# EAGLE design WimarcFarmArduinoShield (EAGLE 7.2.0)
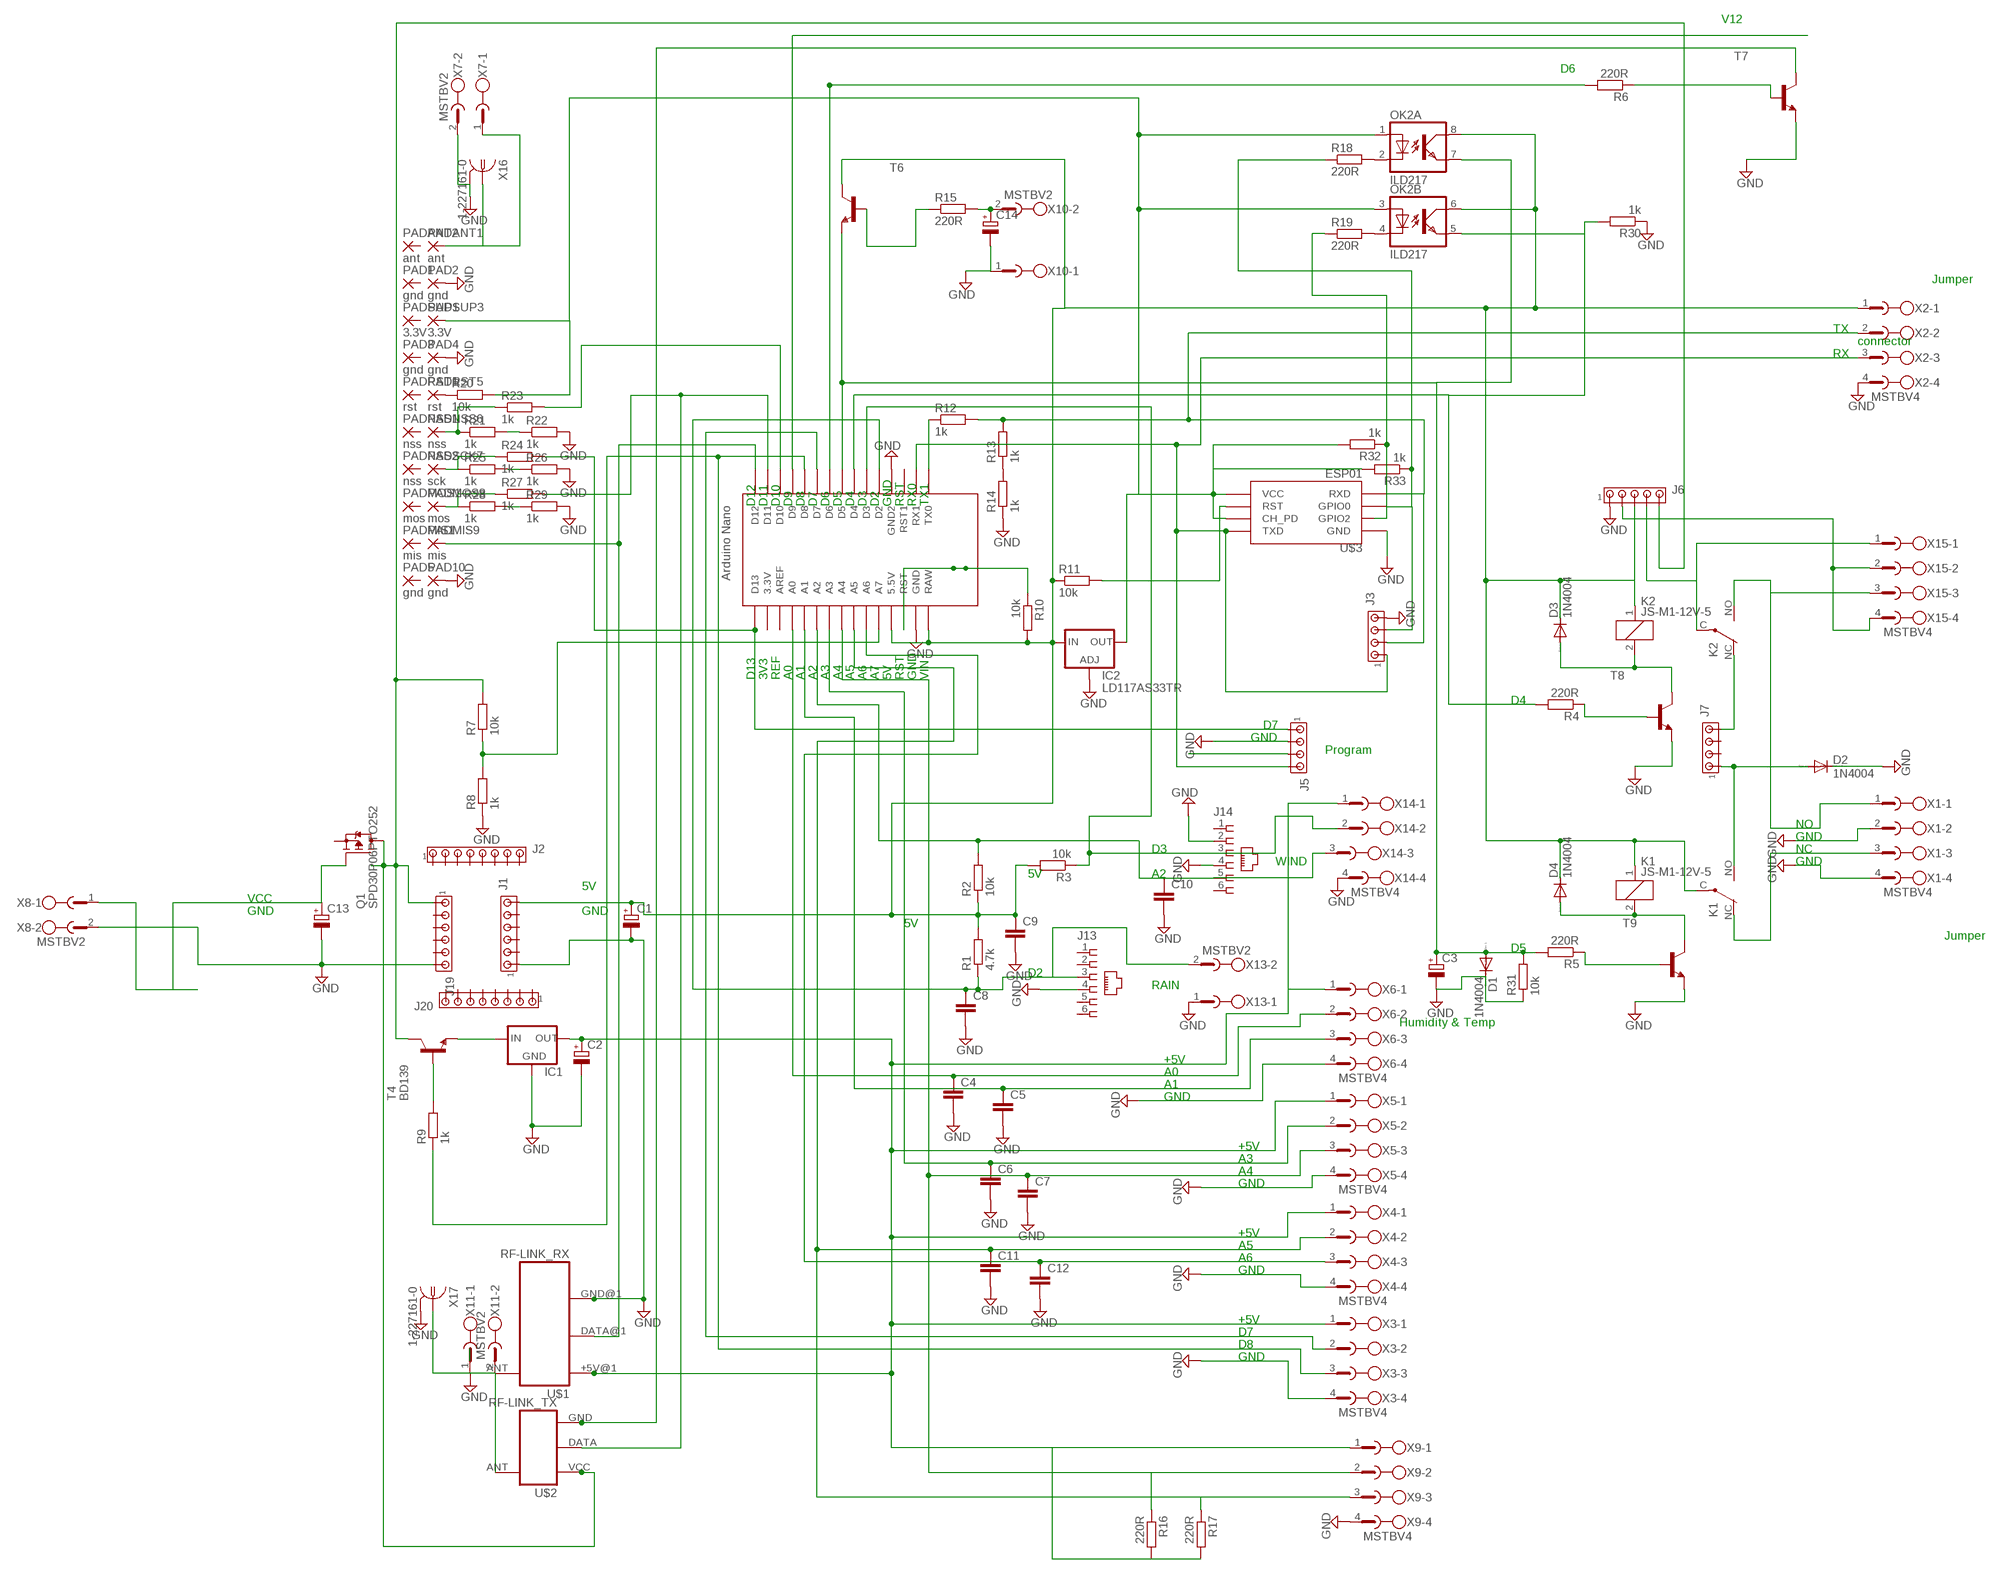
[diagram p0: schematic, sheet 1]

## Parts
C1  CPOL-EUE2.5-7  [E2,5-7]
C2  CPOL-EUE3.5-10  [E3,5-10]
C3  CPOL-EUE2.5-7  [E2,5-7]
C4  C-EUC0805K  [C0805K]
C5  C-EUC0805K  [C0805K]
C6  C-EUC0805K  [C0805K]
C7  C-EUC0805K  [C0805K]
C8  C-EUC0805K  [C0805K]
C9  C-EUC0805K  [C0805K]
C10  C-EUC0805K  [C0805K]
C11  C-EUC0805K  [C0805K]
C12  C-EUC0805K  [C0805K]
C13  CPOL-EUE2.5-7  [E2,5-7]
C14  CPOL-EUE2.5-7  [E2,5-7]
D1  1N4004  [DO41-10]
D2  1N4004  [DO41-10]
D3  1N4004  [DO41-10]
D4  1N4004  [DO41-10]
IC1  78XXS  [78XXS]
IC2  LD117AS33TR  [SOT223]
J1  MTA06-100  [10X06MTA]
J2  MTA08-100  [10X08MTA]
J3  MTA04-100  [10X04MTA]
J5  MTA04-100  [10X04MTA]
J6  MTA05-100  [10X05MTA]
J7  MTA04-100  [10X04MTA]
J13  520250-3  [520250-3]
J14  520250-3  [520250-3]
J19  MTA06-100  [10X06MTA]
J20  MTA08-100  [10X08MTA]
K1  JS-M1-12V-5  [JS-M]
K2  JS-M1-12V-5  [JS-M]
OK2  ILD217  [SOIC08]
PAD1  gnd  1,6/0,8  [1,6/0,8]
PAD2  gnd  1,6/0,8  [1,6/0,8]
PAD3  gnd  1,6/0,8  [1,6/0,8]
PAD4  gnd  1,6/0,8  [1,6/0,8]
PAD5  gnd  1,6/0,8  [1,6/0,8]
PAD10  gnd  1,6/0,8  [1,6/0,8]
PADANT1  ant  1,6/0,8  [1,6/0,8]
PADANT2  ant  1,6/0,8  [1,6/0,8]
PADMIS1  mis  1,6/0,8  [1,6/0,8]
PADMIS9  mis  1,6/0,8  [1,6/0,8]
PADMOS1  mos  1,6/0,8  [1,6/0,8]
PADMOS8  mos  1,6/0,8  [1,6/0,8]
PADNSS1  nss  1,6/0,8  [1,6/0,8]
PADNSS2  nss  1,6/0,8  [1,6/0,8]
PADNSS6  nss  1,6/0,8  [1,6/0,8]
PADRST1  rst  1,6/0,8  [1,6/0,8]
PADRST5  rst  1,6/0,8  [1,6/0,8]
PADSCK7  sck  1,6/0,8  [1,6/0,8]
PADSUP1  3.3V  1,6/0,8  [1,6/0,8]
PADSUP3  3.3V  1,6/0,8  [1,6/0,8]
Q1  SPD30P06PTO252  [TO252]
R1  4.7k  R-EU_M0805  [M0805]
R2  10k  R-EU_M0805  [M0805]
R3  10k  R-EU_M0805  [M0805]
R4  220R  R-EU_M0805  [M0805]
R5  220R  R-EU_M0805  [M0805]
R6  220R  R-EU_M0805  [M0805]
R7  10k  R-EU_M0805  [M0805]
R8  1k  R-EU_M0805  [M0805]
R9  1k  R-EU_M0805  [M0805]
R10  10k  R-EU_M0805  [M0805]
R11  10k  R-EU_M0805  [M0805]
R12  1k  R-EU_M0805  [M0805]
R13  1k  R-EU_M0805  [M0805]
R14  1k  R-EU_M0805  [M0805]
R15  220R  R-EU_M0805  [M0805]
R16  220R  R-EU_M0805  [M0805]
R17  220R  R-EU_M0805  [M0805]
R18  220R  R-EU_M0805  [M0805]
R19  220R  R-EU_M0805  [M0805]
R20  10k  R-EU_M0805  [M0805]
R21  1k  R-EU_M0805  [M0805]
R22  1k  R-EU_M0805  [M0805]
R23  1k  R-EU_M0805  [M0805]
R24  1k  R-EU_M0805  [M0805]
R25  1k  R-EU_M0805  [M0805]
R26  1k  R-EU_M0805  [M0805]
R27  1k  R-EU_M0805  [M0805]
R28  1k  R-EU_M0805  [M0805]
R29  1k  R-EU_M0805  [M0805]
R30  1k  R-EU_M0805  [M0805]
R31  10k  R-EU_M0805  [M0805]
R32  1k  R-EU_M0805  [M0805]
R33  1k  R-EU_M0805  [M0805]
T4  BD139  [TO126]
T6  -NPN-SOT89-BCE  [SOT89-BCE]
T7  -NPN-SOT89-BCE  [SOT89-BCE]
T8  -NPN-SOT89-BCE  [SOT89-BCE]
T9  -NPN-SOT89-BCE  [SOT89-BCE]
U$1  RF-LINK_RX  [RF-LINK_RX]
U$2  RF-LINK_TX  [RF-LINK_TX]
U$3  ESP01  [ESP01]
U$4  NANO  [NANO]
X1  MSTBV4  [MSTBV4]
X2  MSTBV4  [MSTBV4]
X3  MSTBV4  [MSTBV4]
X4  MSTBV4  [MSTBV4]
X5  MSTBV4  [MSTBV4]
X6  MSTBV4  [MSTBV4]
X7  MSTBV2  [MSTBV2]
X8  MSTBV2  [MSTBV2]
X9  MSTBV4  [MSTBV4]
X10  MSTBV2  [MSTBV2]
X11  MSTBV2  [MSTBV2]
X13  MSTBV2  [MSTBV2]
X14  MSTBV4  [MSTBV4]
X15  MSTBV4  [MSTBV4]
X16  1-227161-0  [AMP_227161]
X17  1-227161-0  [AMP_227161]

## Nets
GND: C1.- C2.- C3.- C4.2 C5.2 C6.2 C7.2 C8.2 C9.2 C10.2 C11.2 C12.2 C13.- C14.- D1.C D2.C IC1.GND IC2.1(ADJ) J1.1 J3.4 J5.2 J6.1 J13.4 J14.2 J14.4 J19.6 PAD2.1(P) PAD4.1(P) PAD10.1(P) R8.1 R14.1 R22.2 R26.2 R29.2 R30.1 R31.1 T7.E T8.E T9.E U$1.GND@1(GND) U$3.GND U$4.GND U$4.GND1(GND2) X1.2 X1.4 X2.4 X3.4 X4.4 X5.4 X6.4 X7.2 X8.2 X9.4 X10.1 X11.1 X13.1 X14.4 X16.2 X17.2
N$1: C4.1 U$4.A0 X6.2
N$2: C8.1 J13.3 R1.1 U$4.D2 X13.2
N$3: J14.3 R3.1 U$4.D3 X14.2
N$5: J7.4 K2.NC(2:O)
N$6: J5.1 R24.2 U$4.D13
N$7: C13.+ Q1.1(G) X8.1
N$8: J3.1 J5.4 U$3.TX(TXD) U$4.RX1 X2.3
N$9: J5.3
N$10: U$1.ANT U$2.ANT X11.2 X17.1
N$11: PADMIS9.1(P) U$1.DATA@1(DATA) U$4.D12
N$12: J3.3 R18.1 R33.1 U$3.GPIO0
N$13: C5.1 U$4.A1 X6.3
N$14: C6.1 U$4.A3 X5.2
N$15: C7.1 R16.1 U$4.A4 X5.3 X9.2
N$16: C11.1 R17.1 U$4.A5 X4.2 X9.3
N$17: C12.1 U$4.A6 X4.3
N$18: U$4.D7 X3.2
N$19: R11.2 U$3.RST
N$20: D3.A K2.2 T8.C
N$21: C2.+ IC1.OUT R16.2 R17.2 U$1.+5V@1(+5V) X3.1 X4.1 X5.1 X6.1 X9.1 X14.1
N$22: R4.1 T8.B
N$23: D4.A K1.2 T9.C
N$24: R5.1 T9.B
N$25: K1.NC(2:O) X1.3
N$26: T7.C U$2.GND
N$27: R27.2 U$2.DATA U$4.D11
N$28: K2.NO(2:S) X1.1 X15.3
N$29: R7.1 R8.2 U$4.A7
N$30: R6.1 T7.B
N$31: OK2.5(B:EMIT) R4.2 R30.2 U$4.D4
N$32: C3.+ D1.A OK2.7(A:EMIT) R5.2 R31.2 T6.E U$4.D5
N$33: R6.2 U$4.D6
N$34: R12.1 U$4.TX0
N$35: U$4.D9
N$36: D2.A J7.1 K1.NO(2:S)
N$37: R23.2 U$4.D10
N$38: IC1.IN T4.1(E)
N$39: R9.2 T4.3(B)
N$40: R9.1 U$4.D8 X3.3
N$42: R10.1 U$4.ICSP1 U$4.ICSP2 U$4.RST
N$43: IC2.4(OUT) OK2.1(A:A) OK2.3(B:A) PADSUP3.1(P) R20.2 R32.2 R33.2 U$3.CH_PD U$3.VCC
N$44: J3.2 R12.2 R13.2 U$3.RX(RXD) X2.2
N$47: J6.4 K2.C(2:P) X15.1
N$48: R15.1 T6.B
N$49: C14.+ R15.2 X10.2
N$50: R19.1 R32.1 U$3.GPIO2
N$51: OK2.2(A:C) R18.2
N$52: R13.1 R14.2
N$53: OK2.4(B:C) R19.2
N$54: J6.2 X15.2 X15.4
N$55: C10.1 J14.5 R2.2 U$4.A2 X14.3
N$61: PADSCK7.1(P) R24.1 R25.1
N$62: PADRST5.1(P) R20.1
N$63: PADNSS6.1(P) R21.1 R23.1
N$64: R21.2 R22.1
N$65: R25.2 R26.1
N$66: PADMOS8.1(P) R27.1 R28.1
N$67: R28.2 R29.1
N$68: PADANT1.1(P) X7.1 X16.1
N$72: C1.+ C9.1 D3.C D4.C IC2.3(IN) J1.6 J6.3 K1.1 K1.C(2:P) K2.1 OK2.6(B:COL) OK2.8(A:COL) R1.2 R2.1 R3.2 R10.2 R11.1 T6.C U$4.5V(5.5V) U$4.RAW X2.1
SUPPLY: J6.5 J19.1 Q1.3(D) R7.2 T4.2(C) U$2.VCC(+5V)
Unconnected: J1.2 J1.3 J1.4 J1.5 J2.1 J2.2 J2.3 J2.4 J2.5 J2.6 J2.7 J2.8 J7.2 J7.3 J13.1 J13.2 J13.5 J13.6 J14.1 J14.6 J19.2 J19.3 J19.4 J19.5 J20.1 J20.2 J20.3 J20.4 J20.5 J20.6 J20.7 J20.8 PAD1.1(P) PAD3.1(P) PAD5.1(P) PADANT2.1(P) PADMIS1.1(P) PADMOS1.1(P) PADNSS1.1(P) PADNSS2.1(P) PADRST1.1(P) PADSUP1.1(P) Q1.2(S) U$4.3.3V U$4.AREF U$4.ICSP3 U$4.ICSP4 U$4.ICSP5 U$4.ICSP6 U$4.RST1

## Notes on the sheet
- V12
- D6
- Jumper
- TX
- connector
- RX
- D12 | D11 | D10 | D9 | D8 | D7 | D6 | D5 | D4 | D3 | D2 | GND | RST | RX0 | TX1
- D13 | 3V3 | REF | A0 | A1 | A2 | A3 | A4 | A5 | A6 | A7 | 5V | RST | GND | VIN
- D4
- D7
- GND
- Program
- NO
- GND
- D3 | NC
- WIND | GND
- 5V | A2
- 5V
- VCC
- GND | GND
- 5V
- Jumper
- D5
- D2
- RAIN
- Humidity & Temp
- +5V
- A0
- A1
- GND
- +5V
- A3
- A4
- GND
- +5V
- A5
- A6
- GND
- +5V
- D7
- D8
- GND

## Library data of the parts
C1-C3 C13 C14 = rcl:CPOL-EU: POLARIZED CAPACITOR, European symbol
C4-C12 = rcl:C-EU: CAPACITOR, European symbol
D1-D4 = diode:1N4004: DIODE general purpose rectifier, 1 A
IC1 = v-reg:78XXS: VOLTAGE REGULATOR
IC2 = v-reg:LD117A?*: Low drop fixed and adjustable positive voltage regulators 1 A Source: http://www.st.com/stonline/products/literature/ds/7194/ld1117axx.pdf
J1 J19 = con-amp:MTA06-100: AMP connector Connection corrected 2014-09-19
J2 J20 = con-amp:MTA08-100: AMP connector
J3 J5 J7 = con-amp:MTA04-100: AMP connector
J6 = con-amp:MTA05-100: AMP connector
J13 J14 = con-amp:520250-3: AMP connector
K1 K2 = relay:JS-M1*: Automotive Ultra-Miniature Power Relay NAiS Source: http://www.mew-europe.com/.. en_ds_61211_0000.pdf
OK2 = optocoupler-2:ILD2*: Siemens ILD205/206/207/211/213/217 DUAL PHOTOTRANSISTOR SMALL OUTLINE SURFACE MOUNT OPTOCOUPLER Source: 153385-da-01-en-Optocoupler_ILD205-T.pdf
PAD1-PAD5 PAD10 PADANT1 PADANT2 PADMIS1 PADMIS9 PADMOS1 PADMOS8 PADNSS1 PADNSS2 PADNSS6 PADRST1 PADRST5 PADSCK7 PADSUP1 PADSUP3 = wirepad:1,6/0,8: THROUGH-HOLE PAD
Q1 = transistor-fet:SPD30P06P: SIPMOS(R) Power-Transistor P-Channel, Enhancement mode Source: http://www.infineon.com/upload/Document/cmc_upload/documents/012/3615/SPD_U30P06P.pdf
R1-R33 = resistor:R-EU_: RESISTOR, European symbol
T4 = transistor-npn:BD139*: NPN Transistor
T6-T9 = transistor:*-NPN-: NPN Transistror BF959 corrected 2008.03.06
U$1 = SparkFun-RF:RF-LINK_RX: RF Link receivers- WRL-8947, 8948, 8949, 8950, 10532, 10533
U$2 = SparkFun-RF:RF-LINK_TX: RF Link transmitters WRL-8945, 8946
U$3 = esp8266modules:ESP01: ESP8266 Wifi module 01
U$4 = Arduino-clone:NANO: Arduino Nano
X1-X6 X9 X14 X15 = con-phoenix-508:MSTBV4: PHOENIX
X7 X8 X10 X11 X13 = con-phoenix-508:MSTBV2: PHOENIX
X16 X17 = con-coax:?227161*: JACK, RIGHT ANGLE, 50 OHM, PCB, BNC Source: amp_227161.pdf; MF: TYCO ELECTRONICS; MPN: 1-227161; OC_FARNELL: unknown; OC_NEWARK: 33B3200

## Board
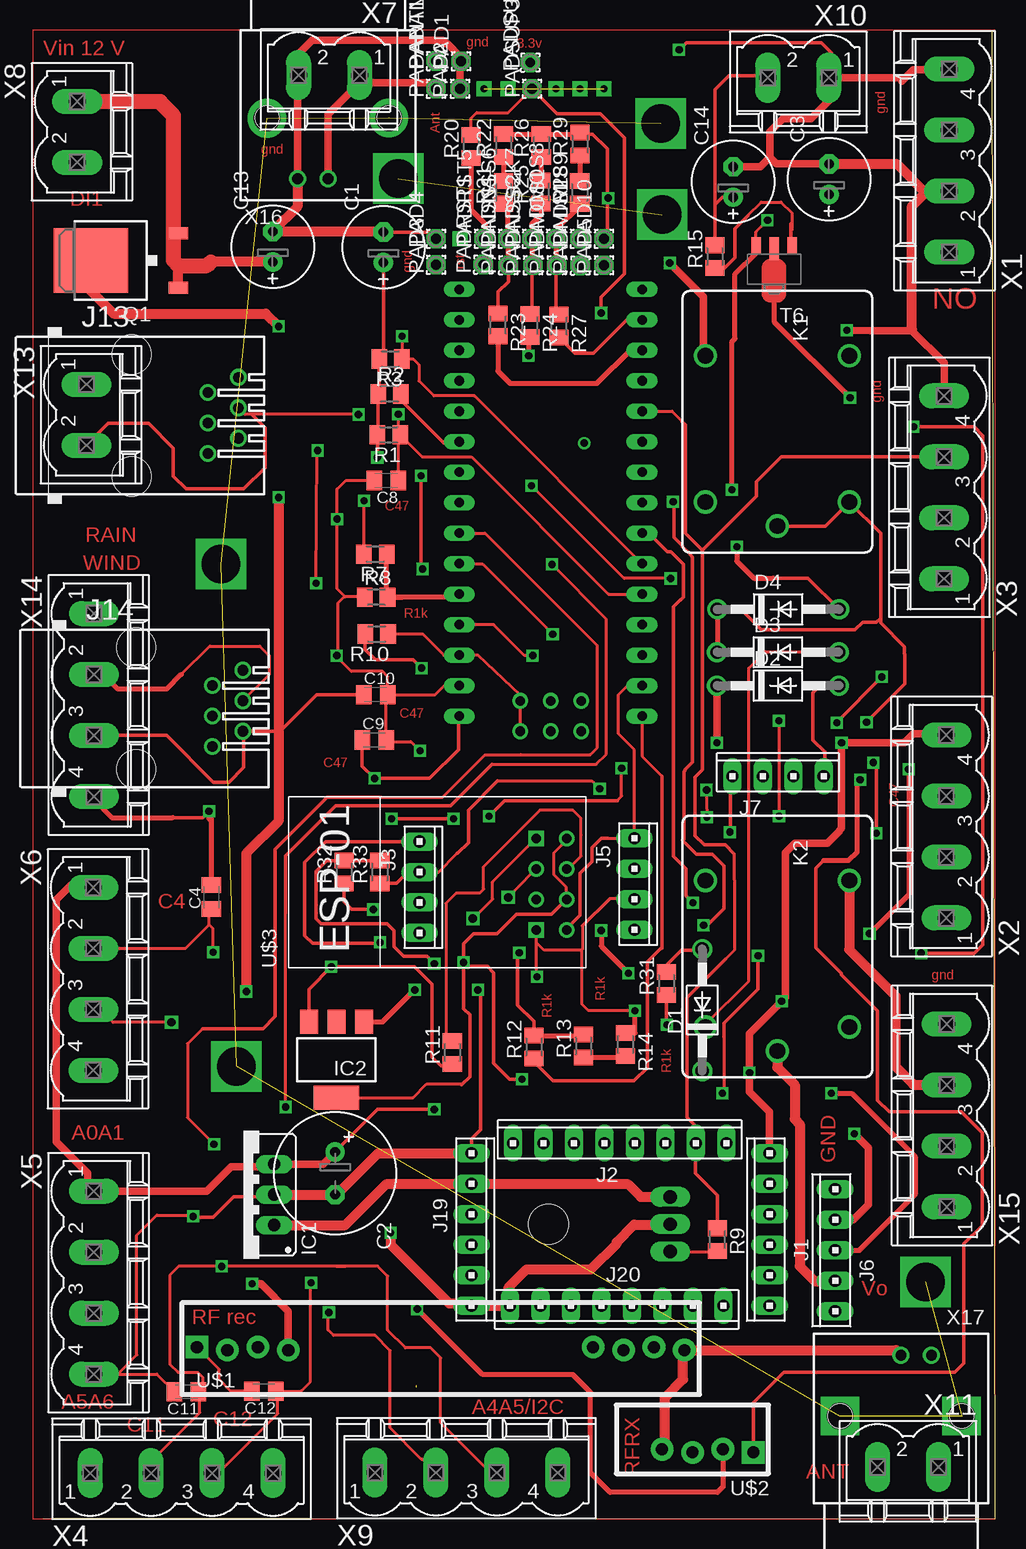
[diagram p1: board, top side]
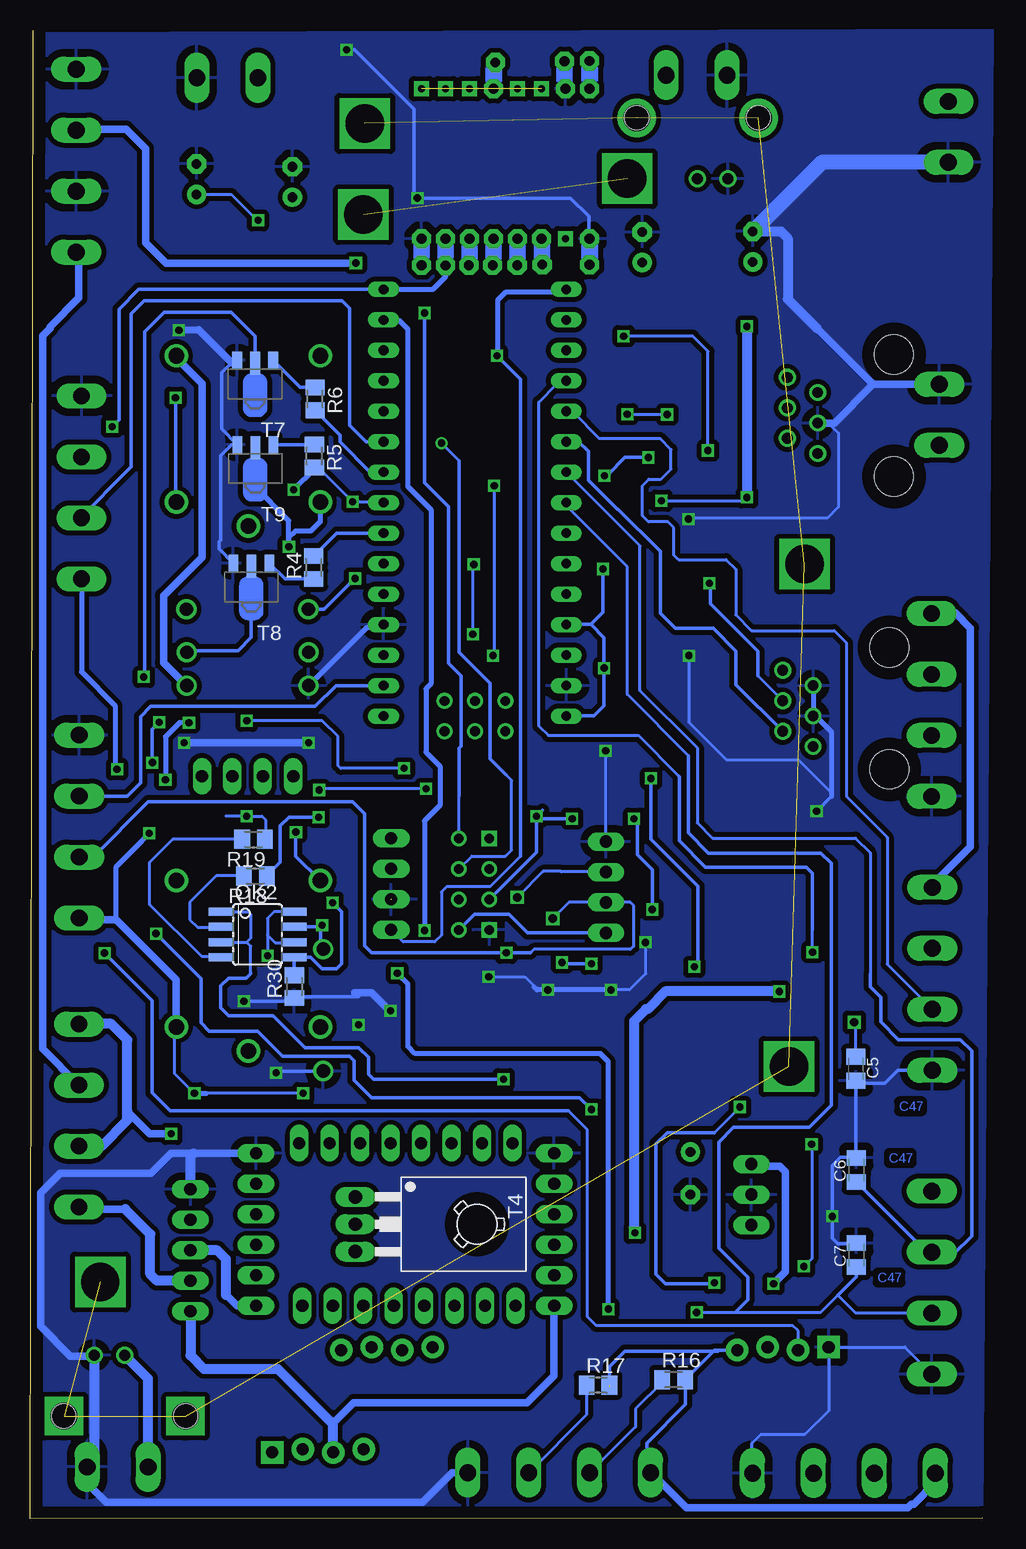
[diagram p2: board, bottom side, seen from below]

Size 79.39 x 124.01 mm. Coordinates in mm from the lower left corner, seen from the top.
Outline: 0,0.03 79.39,0 79.14,124.01
Copper layers (1*16): Top 0.035mm / dielectric 1.5mm / Bottom 0.035mm
Design rules "default *": minimum track width 10mil, minimum drill 24mil, track to track 10mil, track to pad 10mil, pad to pad 10mil, via to via 10mil, smd to smd 10mil, copper to edge 40mil, drill to drill 10mil, minimum pad ring 10mil, minimum via ring 8mil, stop-mask expansion 4mil, vias tented up to drill 0mil, thermal gap 25mil

### Footprints (pad centres in the part's own frame; a part is rotated, then mirrored left to right if it is on the bottom)
E2,5-7 = drill 0.813 pad 1.6: + -1.27,0 | drill 0.813 pad 1.6 octagon: - 1.27,0
E3,5-10 = drill 0.813 pad 1.6: + -1.778,0 | drill 0.813 pad 1.6 octagon: - 1.778,0
C0805K = smd 1.3 x 1.6: 1 -1,0; 2 1,0
DO41-10 = drill 1.118: A 5.08,0; C -5.08,0
78XXS = drill 1.016 long: GND 0,-2.54; IN -2.54,-2.54; OUT 2.54,-2.54
SOT223 = smd 1.5 x 2: 1 -2.3,-3.15; 2 0,-3.15; 3 2.3,-3.15 | smd 3.8 x 2: 4 0,3.15
10X06MTA = drill 1.016 long: 1 6.35,0; 2 3.81,0; 3 1.27,0; 4 -1.27,0; 5 -3.81,0; 6 -6.35,0
10X08MTA = drill 1.016 long: 1 8.89,0; 2 6.35,0; 3 3.81,0; 4 1.27,0; 5 -1.27,0; 6 -3.81,0; 7 -6.35,0; 8 -8.89,0
10X04MTA = drill 1.016 long: 1 3.81,0; 2 1.27,0; 3 -1.27,0; 4 -3.81,0
10X05MTA = drill 1.016 long: 1 5.08,0; 2 2.54,0; 3 0,0; 4 -2.54,0; 5 -5.08,0
520250-3 = drill 0.889: 1 -3.175,8.89; 2 -1.905,6.35; 3 -0.635,8.89; 4 0.635,6.35; 5 1.905,8.89; 6 3.175,6.35 | hole 3.251: -5.08,0; 5.08,0
JS-M = drill 1.3: 1 6.7,6; 2 6.7,-6; C 8.7,0; NC -5.5,-6; NO -5.5,6
SOIC08 = smd 0.66 x 2.032: 1 -1.905,-3.073; 2 -0.635,-3.073; 3 0.635,-3.073; 4 1.905,-3.073; 5 1.905,3.073; 6 0.635,3.073; 7 -0.635,3.073; 8 -1.905,3.073
1,6/0,8 = drill 0.813 pad 1.6 octagon: 1 0,0
TO252 = smd 1 x 1.6: 1 -2.28,-4.8; 2 2.28,-4.8 | smd 5.4 x 6.2: 3 0,2.5
M0805 = smd 1.3 x 1.6: 1 -0.95,0; 2 0.95,0
TO126 = drill 1.118 long: 1 -2.286,-5.08; 2 0,-5.08; 3 2.286,-5.08 | hole 3.302: 0,5.08
SOT89-BCE = smd 0.8 x 1.4: B -1.499,-1.981; E 1.499,-1.981 | smd 0.8 x 1.9: C 0,-1.727
RF-LINK_RX = drill 1.016 pad 1.88: +5V@1 7.62,-0.127; +5V@2 33.02,0.127; ANT 40.64,-0.127; DATA@1 2.54,-0.127; DATA@2 5.08,0.127; GND@2 35.56,-0.127; GND@3 38.1,0.127 | drill 1.016 pad 1.88 square: GND@1 0,0.127
RF-LINK_TX = drill 1.016 pad 1.88: ANT 7.62,-0.127; DATA 2.54,-0.127; VCC 5.08,0.127 | drill 1.016 pad 1.88 square: GND 0,0.127
ESP01 = drill 0.8: CH_PD -1.285,-8.178; GPIO0 1.255,-5.638; GPIO2 -1.285,-5.638; RST 1.255,-8.178; TX -3.825,-8.178; VCC 3.795,-8.178 | drill 0.8 square: GND -3.825,-5.638; RX 3.795,-5.638
NANO = drill 0.8 long: 3.3V -10.16,24.13; 5V -10.16,-1.27; A0 -10.16,19.05; A1 -10.16,16.51; A2 -10.16,13.97; A3 -10.16,11.43; A4 -10.16,8.89; A5 -10.16,6.35; A6 -10.16,3.81; A7 -10.16,1.27; AREF -10.16,21.59; D2 5.08,1.27; D3 5.08,3.81; D4 5.08,6.35; D5 5.08,8.89; D6 5.08,11.43; D7 5.08,13.97; D8 5.08,16.51; D9 5.08,19.05; D10 5.08,21.59; D11 5.08,24.13; D12 5.08,26.67; D13 -10.16,26.67; GND -10.16,-6.35; GND1 5.08,-1.27; RAW -10.16,-8.89; RST -10.16,-3.81; RST1 5.08,-3.81; RX1 5.08,-6.35; TX0 5.08,-8.89 | drill 0.8: ICSP1 -5.08,-10.16; ICSP2 -5.08,-7.62; ICSP3 -2.54,-10.16; ICSP4 -2.54,-7.62; ICSP5 0,-10.16; ICSP6 0,-7.62
MSTBV4 = drill 1.397 long: 1 -7.62,0; 2 -2.54,0; 3 2.54,0; 4 7.62,0
MSTBV2 = drill 1.397 long: 1 -2.54,0; 2 2.54,0
AMP_227161 = drill 0.9 pad 1.27: 1 0,-5.08; 2 -2.54,-5.08 | hole 2: -5.08,0; 5.08,0

### Placement (x,y rotation side)
C1  28.37,105.96 90 top
C2  24.35,28.79 270 top
C3  65.53,111.63 90 top
C4  14.03,51.81 90 top
C5  10.56,37.5 270 bottom
C6  10.51,29.07 90 bottom
C7  10.51,21.98 90 bottom
C8  28.62,86.52 180 top
C9  27.6,64.9 0 top
C10  27.73,68.67 0 top
C11  11.95,10.59 180 top
C12  18.4,10.63 180 top
C13  19.16,106.01 90 top
C14  57.54,111.41 90 top
D1  54.97,42.39 90 top
D2  61.27,69.43 0 top
D3  61.26,72.21 0 top
D4  61.29,75.79 0 top
IC1  16.73,27.02 90 top
IC2  24.46,38.25 180 top
J1  60.57,24.1 90 top
J2  48.08,31.31 0 top
J3  31.39,52.63 270 top
J5  49.3,52.89 270 top
J6  66.04,22.38 90 top
J7  61.27,61.89 0 top
J13  7.39,91.94 270 top
J14  7.77,67.53 270 top
J19  35.71,24.1 270 top
J20  47.82,17.76 180 top
K1  61.22,91.42 270 top
K2  61.22,47.7 270 top
OK2  60.45,48.69 270 bottom
PAD1  34.85,121.46 90 top
PAD2  34.76,119.16 90 top
PAD3  32.77,104.5 90 top
PAD4  32.76,106.66 90 top
PAD5  46.76,104.47 90 top
PAD10  46.76,106.66 90 top
PADANT1  32.76,119.16 90 top
PADANT2  32.77,121.49 90 top
PADMIS1  44.78,104.44 90 top
PADMIS9  44.76,106.66 90 top
PADMOS1  42.82,104.47 90 top
PADMOS8  42.76,106.66 90 top
PADNSS1  38.79,104.47 90 top
PADNSS2  40.84,104.47 90 top
PADNSS6  38.76,106.66 90 top
PADRST1  36.7,104.52 90 top
PADRST5  36.76,106.66 90 top
PADSCK7  40.76,106.66 90 top
PADSUP1  40.61,121.36 90 top
PADSUP3  40.76,119.16 90 top
Q1  6.48,104.85 90 top
R1  28.82,90.33 180 top
R2  28.89,93.73 0 top
R3  28.97,96.65 180 top
R4  55.76,79.28 90 bottom
R5  55.71,88.56 270 bottom
R6  55.65,93.33 270 bottom
R7  27.7,80.39 180 top
R8  27.77,76.79 0 top
R9  56.21,23.26 270 top
R10  27.82,73.73 180 top
R11  34.11,38.86 90 top
R12  40.92,39.32 90 top
R13  45.06,39.4 90 top
R14  48.56,39.52 270 top
R15  56.01,105.18 90 top
R16  25.76,11.58 0 bottom
R17  32.05,11.13 0 bottom
R18  60.63,53.57 180 bottom
R19  60.78,56.62 180 bottom
R20  35.68,114.36 90 top
R21  38.38,110.53 90 top
R22  38.39,114.45 90 top
R23  37.93,99.49 270 top
R24  40.59,99.44 270 top
R25  41.51,110.56 90 top
R26  41.53,114.44 90 top
R27  43.02,99.39 270 top
R28  44.75,110.54 90 top
R29  44.76,114.56 90 top
R30  57.38,44.35 90 bottom
R31  51.97,44.6 90 top
R32  25.1,53.9 90 top
R33  28.07,53.9 90 top
T4  47.22,24.55 270 bottom
T6  60.93,104.11 180 top
T7  60.65,94.57 180 bottom
T8  60.96,77.65 180 bottom
T9  60.63,87.53 180 bottom
U$1  12.83,14.18 0 top
U$2  59.22,5.67 180 top
U$3  35.48,52.9 90 top
U$4  44.86,75.79 0 top
X1  75.56,113.18 90 top
X2  75.31,57.69 90 top
X3  75.12,85.95 90 top
X4  11.55,3.81 0 top
X5  4.23,19.68 270 top
X6  4.19,45 270 top
X7  23.84,120.31 180 top
X8  2.85,115.58 270 top
X9  35.29,3.85 0 top
X10  62.96,120.09 180 top
X11  72.11,4.32 180 top
X13  3.61,92 270 top
X14  4.24,67.82 270 top
X15  75.34,33.6 90 top
X16  23.76,116.76 0 top
X17  71.53,8.56 180 top

### Tracks (layer width: path | path; a pad name or v marks a point on that pad's centre or on a via)
GND  (via drill 0.6)  (1 unrouted)
  Top 0.254: 34.7,69.19 U$4.GND 34.68,69.42 33.43,69.42 32.68,68.67 C10.2 | C11.2 9.48,12.06 X5.4 6.21,12.06 7.82,13.67 7.82,23.65 9.47,25.3 12.42,25.3 v12.52,25.2 | C12.2 15.65,10.63 14.68,11.61 14.68,12.45 U$1.GND@1 | C10.2 28.6,68.55 C9.2 28.73,64.77 30.66,64.77 v31.42,64.01 | C10.2 28.73,70.18 28.3,70.61 25.68,70.61 24.59,71.7 24.59,71.83 | 24.59,71.83 24.59,76.33 25.1,76.83 25.2,76.83 | R8.1 26.77,76.83 25.2,76.83 | U$3.GND 41.11,48.06 | 41.11,48.06 41.11,45.22 v41.17,45.16 | 44.91,47.4 41.77,47.4 41.11,48.06 | 25.2,76.83 24.51,77.52 v24.51,83.31 24.51,85.8 25.25,86.54 27.6,86.54 C8.2 | v24.49,71.93 24.59,71.83 | 27.97,48.16 v28.09,48.03 | 44.91,47.4 44.91,42.9 45.44,42.37 49.33,42.37 v49.35,42.34 | 66.4,58.52 66.57,58.7 | 49.37,51.69 47.27,51.69 | 44.98,49.4 44.98,47.47 44.91,47.4
  Top 0.305: v53.03,122.42 53.62,123.01 64.9,123.01 65.74,122.17 65.74,119.81 65.51,119.58 | J19.6 35.71,31.67 36.47,32.44 36.47,43.84 v36.25,44.07 | v12.52,25.2 12.57,25.15 14.2,25.15 15.88,26.82 19.07,26.82 IC1.GND | 49.3,42.29 v49.35,42.34 | J3.4 23.55,56.44 21.82,54.71 21.82,48.59 22.45,47.96 28.02,47.96 v28.09,48.03 | 44.65,115.39 45.82,115.39 47.04,114.17 47.04,110.13 v47.12,110.06 47.04,109.98 47.04,106.94 PAD10.1 | C1.- 32.2,107.23 PAD4.1 | R31.1 51.97,41.22 v52.02,41.17 | 61.81,42.89 v61.58,43.12 | 44.98,49.4 47.27,51.69 | 10.82,58.42 13.28,58.42 v13.83,58.97
  Top 0.406: 14.02,58.17 14.02,58.78 v13.83,58.97 13.83,58.36 14.02,58.17 | 14.02,58.17 C4.2 | R22.2 R26.2 44.65,115.39 R29.2 | IC2.1 28.32,41.4 v30.99,44.07 | X14.4 4.24,59.92 5.74,58.42 10.82,58.42 | R14.1 49.35,40.47 v49.35,42.34
  Top 0.61: 71.6,119.81 71.88,120.09 | X1.4 75.51,120.75 72.54,120.75 71.88,120.09 | J1.1 60.57,33.92 58.9,35.59 v58.9,37.16 58.9,40.44 v61.58,43.12 61.87,43.41 61.87,55.5 62.66,56.29 65.38,56.29 66.37,57.28 66.37,57.35 66.57,57.56 66.57,58.7 v66.57,64.67 71.81,64.67 72.57,65.43 74.73,65.43 75.18,65.89 76.1,64.97 75.65,64.97 X2.4 | X16.2 21.22,120.56 21.56,120.9 21.56,120.57 X7.2 21.29,120.32 21.29,122.07 22.43,123.22 33.3,123.22 33.6,122.91 33.71,122.91 34.76,121.85 PAD2.1 | 71.88,120.09 X10.1 65.51,119.58 65.51,118.16 64.01,116.66 61.67,116.66 60.58,115.57 60.58,113.46 | C14.- 59.79,112.68 60.58,113.46 | X3.4 75.12,96.33 72.44,99.01 72.34,99.01 | 72.34,99.01 68.96,99.01 v67.01,99.03 | 72.44,99.11 72.34,99.01 | C3.- 61.14,112.9 60.58,113.46 | v56.18,64.67 D2.C
  Top 0.813: X16.2 21.22,109.34 C13.- 28.33,107.28 C1.- | IC1.GND C2.- 24.47,27.01 27.91,30.45 J19.6 | 72.44,99.11 72.44,109.4 73.56,110.52 | 73.56,110.52 73.81,110.77 75.46,110.77 75.51,110.72 | C3.- 71.17,112.9 73.56,110.52
  Bottom 0.254: X4.4 19.25,3.89 19.25,6.27 18.52,7.01 14.83,7.01 12.83,9.01 U$1.GND@1 6.47,14.3 X5.4 | v31.42,64.01 31.42,56.46 J3.4 | v41.17,45.16 38.15,45.16 37.39,44.4 37.39,44.3 | J13.4 12.85,91.31 12.01,90.47 12.01,84.33 12.95,83.39 24.43,83.39 v24.51,83.31 | v24.49,71.93 24.49,66.4 21.34,63.25 15.34,63.25 12.6,60.5 | v28.09,48.03 28.09,45.42 29.44,44.07 v30.99,44.07
  Bottom 0.305: T7.E 62.4,96.55 62.61,96.34 63.45,95.5 63.45,90.83 T9.E 62.59,89.51 63.53,88.57 63.53,81.56 63.65,81.43 63.65,80.82 T8.E | X6.4 7.07,37.38 8.15,36.3 10.36,36.3 C5.2 10.56,30.12 | 10.56,30.12 C6.2 | 19.07,26.82 IC1.GND | 10.56,30.12 11.87,30.12 12.52,29.46 v12.52,25.2 12.52,23.39 12.07,22.94 10.55,22.94 C7.2 | PAD4.1 32.82,106.71 32.82,108.53 34.34,110.06 v47.12,110.06 47.4,110.34 47.4,117.45 52.37,122.42 v53.03,122.42 | 52.35,43.84 52.02,43.51 57.27,43.51 R30.1 57.66,43.12 v61.58,43.12 | D1.C 58.75,37.31 v58.9,37.16 | 12.6,60.2 v13.83,58.97
  Bottom 0.406: J14.2 J14.4 13.91,66.89 12.6,65.58 12.6,60.5 12.6,60.2 | v30.99,44.07 v36.25,44.07 37.16,44.07 37.39,44.3 | 49.94,74.27 51.35,74.27 D2.C
  Bottom 0.61: J13.4 12.37,91.31 9.14,94.54 | X13.1 9.14,94.54 | 13.84,99.24 9.14,94.54 | v67.01,99.03 65.35,99.09 62.61,96.34 | v49.35,42.34 49.45,42.34 50.95,43.84 52.35,43.84 | v66.57,64.67 v56.18,64.67 | X9.4 44.24,3.85 46.69,1.4 73.05,1.4 74.68,3.02 74.68,4.3 X11.1 | J1.1 65.81,30.45 67.64,30.45 69.32,28.78 76.91,28.78 78.51,27.18 78.51,16.03 76.05,13.56 74.14,13.56 X17.2
  Bottom 0.813: C13.- 16.81,107.28 16.24,106.71 16.24,101.63 13.84,99.24 | X17.2 74.07,4.91 X11.1 | 21.21,120.22 X7.2 | J6.1 66.04,30.23 65.81,30.45
  Bottom 1.27: X8.2 13.4,113.04 C13.-
  pour Bottom (isolate 0.406): -0.86,124.05 79.17,123.75 79.27,0.41 0,0.03
N$1  (via drill 0.6)
  Top 0.254: X6.2 11.87,47.54 13.84,49.5 | 13.84,49.5 13.84,50.62 C4.1 | v14.17,47.22 14.17,49.17 13.84,49.5
  Bottom 0.254: U$4.A0 34.7,94.59 35.46,94.59 36.98,93.07 36.98,66.07 36.2,65.28 28.7,65.28 25.3,61.87 | v14.17,47.22 14.17,49.07
  Bottom 0.305: 14.17,49.07 14.17,53.8 14.68,54.31 23.09,54.31 25.27,56.49 25.27,61.85 25.3,61.87
N$2  (via drill 0.6)
  Top 0.254: U$4.D2 47.14,77.06 35.71,88.49 31.61,88.49 R1.1 | R1.1 29.62,90.92 v29.62,92.05 | C8.1 29.62,90.18 R1.1 | v29.62,92.05 | v26.29,92.02 17.37,92.02 16.83,92.02 J13.3
  Top 0.305: X13.2 5.44,91.29 8.79,91.29 10.85,89.23 10.85,86.89 11.91,85.83 16.71,85.83 18.49,87.6 18.49,90.91 17.37,92.02
  Bottom 0.254: v29.62,92.05 26.31,92.05 v26.29,92.02
N$3  (via drill 0.6)
  Top 0.254: U$4.D3 35.97,93.57 32.59,93.57 31.34,94.82 31.34,96.16 30.86,96.65 R3.1 v29.92,98.55 | v22.76,77.95 22.83,88.98 v22.89,89.03 | 11.53,70.36 13.89,72.72 18.06,72.72 18.85,71.93 18.85,70.35 J14.3
  Top 0.305: 30.02,96.14 30.02,96.55 R3.1
  Top 0.406: X14.2 5,70.36 6.17,69.19 10.36,69.19 11.53,70.36
  Bottom 0.254: v22.89,89.03 22.89,97.28 24.16,98.55 v29.92,98.55 | 18.75,70.26 J14.3
  Bottom 0.305: 18.75,70.26 18.75,72.29 22.71,76.25 22.71,77.9 v22.76,77.95
N$4
  Top 0.02: 79.4,0.01 79.4,124.05 -0.86,124.05 -0.86,0.01 79.4,0.01
N$5  (via drill 0.6)
  Top 0.254: 57.3,61.82 J7.4
  Top 0.305: 57.3,61.82 57.3,57.28 v57.25,57.23
  Bottom 0.305: v57.25,57.23 57.25,55.23 K2.NC
N$6  (via drill 0.6)
  Top 0.406: R24.2 40.49,98.49 v40.49,96.93
  Bottom 0.254: 38.51,55.22 41.05,52.68 44.68,52.68 45.11,52.25 45.11,48.64 45.67,48.08 48.3,48.08 J5.1 49.17,49.12 | 34.7,102.21 U$4.D13
  Bottom 0.305: 38.51,55.22 38.51,94.95 v40.49,96.93
  Bottom 0.406: 34.7,102.21 39.78,102.21 40.44,101.55 40.44,96.98 v40.49,96.93
N$7
  Top 0.813: Q1.1 11.28,104.44 | C13.+ 13.98,104.74
  Top 1.27: X8.1 9.8,118.12 9.8,117.99 10.85,116.94 10.85,104.87 11.28,104.44 13.68,104.44 13.98,104.74
N$8
  Top 0.254: U$4.RX1 48.73,69.44 47.96,68.66 47.96,65.43 49.3,64.08 J5.4 49.29,56.72 47.09,56.72 | U$3.TX 43.65,49.24
  Top 0.305: 47.09,56.72 46.56,56.72 45.75,55.91 45.75,54.76 44.78,53.8 44.78,50.29 43.73,49.24 43.65,49.24
  Bottom 0.305: X2.3 71.32,60.23 70.21,61.34 70.21,66.85 69.34,67.72 55.63,67.72 53.91,69.44 U$4.RX1 | J3.1 37.92,48.82 39.47,50.37 42.36,50.37 U$3.TX
N$10
  Top 0.254: 53.34,14 U$1.ANT
  Top 0.813: X17.1 71.12,14.05 U$1.ANT 53.37,13.94 53.37,11.61 51.82,10.06 51.82,6.01 U$2.ANT
  Bottom 0.813: X11.2 69.57,11.68 X17.1
N$11  (via drill 0.6)
  Top 0.305: v73.2,47.14 77.52,47.14 77.6,47.07 78.36,47.83 78.36,90.27 77.62,91.01 v72.57,91.01
  Bottom 0.254: U$1.DATA@1 15.37,15.65 15.82,16.1 32.21,16.1 32.94,16.84 32.94,32.44 34.52,34.01
  Bottom 0.305: U$4.D12 70.34,102.46 71.98,100.81 71.98,91.59 v72.57,91.01 | 34.52,34.01 67.74,34.01 69.22,35.48 69.22,43.15 v73.2,47.14
  Bottom 0.406: PADMIS9.1 44.76,103.52 45.85,102.44 49.92,102.44 U$4.D12
N$12  (via drill 0.6, 0.7)
  Top 0.254: v38.79,51.79 39.43,52.48 U$3.GPIO0 | J3.3 32.97,53.9 34.52,55.45 | 37.9,61.49 45.75,61.49 v46.41,60.83 | v55.32,60.73 55.32,59.84 v55.35,58.47
  Top 0.305: R33.1 29.45,52.95 30.4,53.9 J3.3 | 34.52,55.45 34.57,55.45 35.46,56.34 35.46,59.05 37.9,61.49
  Bottom 0.254: 35.15,53.95 36.63,53.95 v38.79,51.79 | 35.1,53.9 35.15,53.95 | v46.41,60.83 55.22,60.83 v55.32,60.73 | 35.15,53.95 31.45,53.95 J3.3
  Bottom 0.305: 59.21,53.57 R18.1 58.55,54.7 58.55,57.73 57.81,58.47 v55.35,58.47
N$13  (via drill 0.7)
  Top 0.254: v10.69,41.38 5.84,41.38 4.7,42.52 4.25,42.52 X6.3
  Bottom 0.254: C5.1 10.57,41.34 v10.69,41.38 | X6.3 7.95,46.22 7.95,56.79 11.35,60.2 11.35,73 12.37,74.02 19.25,74.02 20.57,75.34 20.57,79.12 21.39,79.93 25.35,79.93 25.73,80.31 25.73,82.58 26.24,83.08 27.84,83.08 28.35,83.59 28.35,86.11 27.81,86.64 26.8,86.64 25.96,87.48 25.96,89.1 26.87,90.02 31.93,90.02 34.21,92.3 U$4.A1
N$14
  Bottom 0.254: 34.7,86.97 U$4.A3 28.55,81.07 28.55,69.01 23.77,64.24 23.77,57.99 22.5,56.72 10.59,56.72 9.37,55.5 9.37,45.42
  Bottom 0.305: 9.37,45.42 9.37,44.35 8.48,43.46 8.48,41.4 7.01,39.93 1.85,39.93 0.91,38.99 0.91,23.55 2.39,22.07 4.08,22.07 X5.2 4.66,22.22 C6.1
N$15  (via drill 0.6)
  Top 0.254: v23.83,17.2 23.75,17.12 23.75,15.75 24.21,15.29 27.66,15.29 28.93,14.02 28.93,7.57 31.52,4.98 31.62,4.98 X9.2
  Bottom 0.254: U$4.A4 34.7,84.43 29.62,79.35 29.62,68.71 24.51,63.6 | 32.51,4.09 X9.2 28.93,7.66 28.93,9.17 26.71,11.39 R16.1 | X5.3 10.58,17.14 12.07,18.62 13.49,17.2 20.6,17.2 v23.83,17.2
  Bottom 0.305: C7.1 10.51,20.17 12.07,18.62 | 20.6,17.2 19.56,18.24 19.56,20.12 21.97,22.53 21.97,31.39 20.75,32.61 14.45,32.61 12.6,34.47 12.6,54.61 13.46,55.47 22.83,55.47 24.51,57.15 24.51,63.6
N$16  (via drill 0.6)
  Top 0.254: U$4.A5 36.84,82.14 46.2,72.77 46.2,64.26 45.62,63.68 39.83,63.68 39.8,63.65 36.83,63.65 33.3,60.12 28.17,60.12 | 11.53,12.19 12.9,12.19 13.28,11.81 13.28,10.92 C11.1 13.06,10.48 13.06,8.84 9.01,4.79 X4.2 | X9.3 37.3,3.85 33.15,8 33.15,13.41 32.31,14.25 30.2,14.25 28.73,15.72 28.73,20.22 27.89,21.06 25.2,21.06 | 24.49,21.03 v14.88,21.03 11.3,21.03 10.57,20.29 10.57,12.88 11.25,12.19 | 13.28,40.84 12.04,39.6 12.04,33.43 v14.25,31.22
  Top 0.305: 11.53,12.19 11.25,12.19 | 25.2,21.06 24.51,21.06 24.49,21.03 | 28.17,60.12 23.7,60.12 19.35,55.78 19.35,41.86 18.34,40.84 13.28,40.84
  Bottom 0.254: R17.1 33,8.67 X9.3 | v14.25,31.22 14.25,21.67 v14.88,21.03
N$17  (via drill 0.6)
  Top 0.254: X4.3 14.6,3.81 19.56,8.76 19.56,10.48 C12.1 21.51,10.63 22.3,11.43 22.3,19.61 v22.35,19.66 | v20.22,34.32 20.22,50.52 | v42.49,73.71 36.68,79.53 34.76,79.53 U$4.A6 | 37.41,62.86 46.1,62.86 46.96,63.73 46.96,74.98 v42.42,79.53
  Top 0.305: 20.22,50.52 20.22,55.24 24.38,59.41 33.96,59.41 37.41,62.86
  Bottom 0.254: v42.49,73.71 42.49,79.45 v42.42,79.53 | 22.35,32.18 v20.22,34.32
  Bottom 0.305: 22.35,32.18 26.29,32.18 27.23,31.24 27.23,20.37 26.44,19.58 22.43,19.58 v22.35,19.66
N$18
  Bottom 0.305: U$4.D7 51.38,89.76 52.76,91.14 52.76,100.86 53.39,101.5 69.88,101.5 70.97,100.41 70.97,87.66 75.54,83.08 75.45,83.08 X3.2
N$19  (via drill 0.61)
  Top 0.254: U$3.RST 43.84,54.2 44.86,55.22 44.86,57 44.83,57 44.83,58.39 44.17,59.05 41.43,59.05 36.73,54.36 36.73,52.48 36.4,52.15 34.44,52.15 33.58,51.28 33.58,40.35 R11.2 34.39,40.09
  Bottom 0.254: U$3.RST 43.59,54.2 42.57,55.22 39.78,55.22 39.27,55.73 39.27,61.54 39.73,62 | 43.64,88.16 v45.11,89.64
  Bottom 0.305: 43.64,88.16 43.64,72.21 41.07,69.65 41.07,63.35 39.73,62
N$20
  Top 0.254: 66.19,71.98 D3.A 66.29,72.26 60.2,72.26 58.83,70.89 58.83,44.81 55.27,41.25 K2.2
  Bottom 0.305: T8.C 60.96,73.46 62.08,72.34 66.22,72.34 D3.A
N$21  (via drill 0.6)  (1 unrouted)
  Top 0.305: v32.61,34.11 27.89,34.11 C2.+
  Top 0.406: v72.16,62.46 72.16,52.02 v68.91,48.77
  Top 0.61: v17.42,19.58 18.16,19.58 20.45,17.3 U$1.+5V@1 | C2.+ 23.34,29.56 IC1.OUT 19.05,29.34 15.7,29.34 13.66,27.3 X5.1 3.78,27.3 3.73,27.25 3.73,28.78 1.09,31.42 1.09,51.59 2.29,52.78 4.02,52.78 X6.1
  Bottom 0.305: X9.1 27.82,3.85 27.99,4.01 27.99,4.22 27.99,6.3 24.77,9.52 24.77,11.54 R16.2 22.34,14.05 22,14.05 | U$1.+5V@1 22,14.05 | 31.1,10.96 30.99,10.85 | R17.2 31.1,12.66 29.79,13.97 22.07,13.97 22,14.05 | v32.61,34.11 33.6,35.1 50.93,35.1 52.37,36.55 52.37,38.15 52.78,38.56 58.34,38.56 60.43,40.64 64.47,40.64 65.15,41.33 65.15,45.01 v68.91,48.77
  Bottom 0.406: X3.1 75.12,70.58 72.31,67.77 72.31,62.61 v72.16,62.46 | v68.91,48.77 68.83,48.77
  Bottom 0.61: X4.1 3.93,3.03 5.74,1.22 5.92,1.22 6.22,0.91 24.69,0.91 27.99,4.22 | IC1.OUT 19.1,29.39 16.89,29.39 16.43,28.93 16.43,20.57 v17.42,19.58 | X6.1 4.19,52.84 1.02,56.01 1.02,74.22 2.29,75.49 4.19,75.49 X14.1
N$22
  Bottom 0.305: R4.1 58.16,78.33 T8.B
N$23  (via drill 0.6)
  Top 0.305: 60.88,78.38 63.78,78.38 D4.A
  Top 0.406: v57.84,81 57.84,79.81 59.26,78.38 60.88,78.38
  Bottom 0.305: T9.C 60.63,87.58
  Bottom 0.406: K1.2 55.22,83.08 56.01,82.3 57.28,82.3 57.84,81.74 v57.84,81 57.84,83.18 60.73,86.08 60.73,87.48 60.63,87.58
N$24
  Bottom 0.305: R5.1 T9.B
N$25  (via drill 0.6)
  Top 0.61: K1.NC 55.07,97.08 55.07,101.83 v52.25,104.65
  Bottom 0.61: v52.25,104.65 68.07,104.65 69.77,106.35 69.77,114.17 71.4,115.8 76,115.8 76.17,115.62 75.65,115.62 X1.3
N$26  (via drill 0.6)
  Top 0.305: U$2.GND 59.22,9.66 61.77,12.22 76,12.22 76.76,12.98 76.76,22.91 78.28,24.43 78.28,32.18 76.56,33.91 70.54,33.91 69.57,34.87 69.57,42.32 66.55,45.34 66.55,45.47 64.44,47.57 64.44,54.23 65.07,54.86 | v66.17,66.34 66.17,66.4 v69.93,70.15
  Top 0.406: 65.07,54.86 67.16,54.86 67.87,55.58 67.87,61.34 v68.12,61.59
  Bottom 0.305: T7.C 60.65,98.54 62.66,100.56 68.22,100.56 69.85,98.93 69.85,70.23 v69.93,70.15
  Bottom 0.406: v66.17,66.34 66.95,66.34 68.12,65.18 v68.12,61.59
N$27  (via drill 0.6)
  Top 0.305: R27.2 44.33,97.13 45.91,97.13 48.69,99.92 U$4.D11
  Top 0.406: U$2.DATA 56.68,2.65 56.24,2.21 47.27,2.21 45.64,3.84 45.64,10.54 44.17,12.01 36.65,12.01 v31.19,17.48 | v46.53,49.02 46.53,47.73 v48.79,45.47
  Bottom 0.406: v31.19,17.48 31.19,38.1 31.85,38.76 47.29,38.76 47.9,39.37 47.9,44.58 v48.79,45.47 | U$4.D11 48.69,99.92 47.93,99.16 47.93,86.03 46,84.1 46,69.57 46.41,69.16 46.41,63.88 45.24,62.71 45.24,59.46 46.53,58.17 v46.53,49.02
N$28
  Top 0.813: K2.NO 67.22,47.44 71.07,43.59 71.07,37.69 72.59,36.17 75.31,36.17 X15.3
  Bottom 0.254: 75.34,105.51 X1.1
  Bottom 0.61: 75.34,105.51 75.34,101.75 77.75,99.34 77.75,99.21 78.36,98.6 78.36,39.17 X15.3
N$29
  Top 0.254: 34.7,76.81 U$4.A7
  Top 0.406: 34.7,76.81 30.03,76.81 28.65,76.78 | 28.65,76.78 R7.1 | R8.2 29.97,76.81 28.65,76.78
N$30
  Bottom 0.305: R6.1 56.88,94.28 T7.B
N$31  (via drill 0.6)
  Top 0.305: U$4.D4 50.5,82.14 52.06,80.57 52.35,80.57 53.39,79.53 53.39,76.78 53.19,76.58 53.14,76.58 52.55,76 52.55,55.19 53.59,54.15 53.59,51.92 v54.18,51.33
  Bottom 0.305: U$4.D4 53.85,82.14 R4.2 | R30.2 OK2.5 56.01,46.79 55.07,45.85 53.85,45.85 53.44,46.25 53.44,50.57 54.18,51.31 v54.18,51.33
N$32  (via drill 0.6)
  Top 0.254: T6.E 59.44,107.24 v60.4,108.2
  Top 0.305: v55.07,49.45 55.37,49.45 56.74,50.83 56.74,54.43 55.8,55.37 54.48,55.37 53.31,56.54 53.42,56.64 53.42,62.26 53.52,62.36 53.52,62.41 54.15,63.04 54.15,80.14 53.95,80.34 53.95,80.37 53.31,81 53.31,81.08 52.58,81.81 52.58,84.71 v52.53,84.76 | D1.A 54.89,47.4 53.24,47.4 51.97,46.13 R31.2
  Top 0.406: v57.43,85.75 57.43,98.09 57.68,98.35 57.68,103.73 59.46,105.51 59.46,106.07 T6.E
  Bottom 0.254: R5.2 55.38,87.61 v52.53,84.76 | 51.97,84.76 50.02,84.76 U$4.D5 | v60.4,108.2 60.48,108.2 62.61,110.34 65.51,110.34 C3.+
  Bottom 0.305: OK2.7 55.19,49.33 | 55.19,49.33 v55.07,49.45 | v52.53,84.76 51.97,84.76 | 55.19,49.33 55.19,47.7 D1.A
  Bottom 0.406: R5.2 55.71,87.47 v57.43,85.75
N$33
  Bottom 0.305: U$4.D6 51.05,87.22 53.57,89.74 53.57,90.3 R6.2
N$34
  Top 0.254: U$4.TX0 49.94,63.55 51.61,61.87
  Top 0.305: 51.61,61.87 51.61,47.55 51.51,47.55 50.37,46.41 50.37,37.59 49.28,36.5 42.49,36.5 40.92,38.07 R12.1
N$36
  Top 0.254: 65.18,62.08 J7.1
  Top 0.305: 65.18,62.08 65.18,63.91 64.19,64.9 64.19,68.83 64.8,69.44 66.34,69.44 D2.A
  Bottom 0.61: K1.NO 67.22,96.73 65.07,94.59 65.07,80.14 68.28,76.94 68.28,71.36 D2.A
N$37
  Top 0.406: R23.2 37.92,98.54 37.92,95.63 38.94,94.61 46.18,94.61 49,97.43 49.88,97.43 U$4.D10
N$38
  Top 0.813: IC1.IN 25.19,24.48 28.58,27.86 48.79,27.86 49.83,26.82 52.29,26.82 T4.1
N$39
  Top 0.254: T4.3 56.16,22.26 R9.2
N$40
  Top 0.254: U$4.D8 52.43,92.3 53.26,91.47 | 56.9,46.63 57.63,47.37 57.63,53.26 57.61,53.29 57.61,55.42
  Top 0.305: 56.9,46.63 53.67,43.41 53.67,33.48 54.41,32.74 54.41,28.8 56.24,26.97 56.24,24.23 R9.1 | 57.61,55.42 56.87,56.16 55.12,56.16 54.36,56.92 54.36,61.8 54.97,62.41 54.97,80.7 | X3.3 61.57,88.49 59.49,86.41 59.49,85.22 54.97,80.7 | 53.26,91.47 53.26,91.44 53.54,91.16 53.54,82.12 54.97,80.7
N$42
  Top 0.254: U$4.ICSP1 U$4.ICSP2 39.78,68.68 36.22,71.98 35.97,71.98 U$4.RST 34.68,71.96 33.43,71.96 31.65,73.73 R10.1
N$43  (via drill 0.6)
  Top 0.254: U$3.VCC 43.59,56.49 42.57,55.47 42.57,53.7 43.59,52.68 43.59,51.66 U$3.CH_PD 43.59,51.41 | 23.77,35.66 IC2.4 30.84,35.1 31.98,36.25 34.82,36.25 34.9,36.17 | R20.2 35.68,116.71 36.14,117.17 38.77,117.17 PADSUP3.1
  Top 0.305: PADSUP3.1 42.83,117.09 46.46,117.09 48.46,115.09 48.46,103.76 46.51,101.8 46.51,100.51 v46.53,100.48 | 34.9,36.17 35.59,36.86 35.59,41.99 35.05,42.52 35.05,45.87 | 35.05,45.87 v35.05,46.35 35.05,47.9 35.89,48.74 37.85,48.74 39.47,50.37 42.41,50.37 U$3.CH_PD | v39.93,36.63 38.89,36.63 37.57,37.95 37.57,45.49 37.03,46.02 35.2,46.02 35.05,45.87 | R33.2 R32.2 23.63,54.85 22.76,53.97 22.76,50.01 23.19,49.58 28.68,49.58 29.26,49 29.26,47.65 30.05,46.86 32,46.86 v32.61,46.25
  Bottom 0.254: OK2.3 61.34,48.06 | U$3.VCC 43.65,60.27 | 61.01,45.54 61.01,47.73 61.34,48.06 | OK2.1 61.24,50.6 61.01,50.37 61.01,48.39 61.34,48.06
  Bottom 0.305: v46.53,100.48 46.53,86.33 44.53,84.33 44.53,71.3 43.48,70.26 43.48,64.36 43.65,64.19 43.65,60.27 | v32.61,46.25 34.95,46.25 v35.05,46.35 | v39.93,36.63 50.77,36.63 51.21,37.06 51.21,38.46 52.02,39.27 56.46,39.27 59.13,41.94 62.87,41.94 63.5,42.57 63.5,44.42 62.87,45.06 61.39,45.06 61.01,45.44 61.01,45.54
N$44  (via drill 0.6, 0.7)
  Top 0.254: v35.84,50.01 35.86,50.01 37.49,51.64 37.49,53.07 U$3.RX
  Top 0.305: R12.2 40.92,41.45 39.57,42.8 39.57,47.04 v39.7,47.17
  Top 0.406: R12.2 45.06,40.27 R13.2
  Bottom 0.254: v35.84,50.01 34.49,51.36 J3.2 29.36,51.36 29.08,51.08 29.08,47.7 29.11,47.7 29.36,47.45 37.41,47.45 37.69,47.17
  Bottom 0.305: X2.2 74.16,55.15 69.55,59.77 52.53,59.77 51.51,58.75 51.51,47.75 50.93,47.17 v39.7,47.17 37.69,47.17 | U$3.RX 41.11,57.09
N$46  (via drill 2.2, 3.2)  (7 unrouted)
  other vias: 14.83,79.55 51.5,116.28 16.13,37.69 73.56,19.74 66.45,8.56 76.58,8.56 18.67,116.71 28.83,116.74
N$47
  Top 0.813: K2.C 61.22,37.61 62.66,36.17 62.66,33.32 63.09,32.89 63.09,21.06 64.36,19.79 65.99,19.79 J6.4
  Bottom 0.61: 71.48,25.81 75.16,25.81 X15.1
  Bottom 0.813: J6.4 68.83,19.84 69.39,20.4 69.39,23.72 71.48,25.81
N$48
  Top 0.254: 58.75,108.58 58.75,108.61 59.87,109.73 61.52,109.73 62.41,108.84 62.41,107.39 62.36,107.34
  Top 0.305: R15.1 56.81,104.23 57.68,105.11 57.68,107.52 58.75,108.58 | 62.36,107.92 62.36,107.34 62.36,106.17 T6.B
N$49
  Top 0.305: R15.2 56.01,109.5 | 56.01,109.5 56.01,119.08 57.18,120.24 60.27,120.24 X10.2 | C14.+ 56.64,110.14 56.01,109.5
N$50  (via drill 0.6)
  Top 0.254: 47.9,59.84 47.9,59.89 48.23,60.22 v48.23,62.53 | v61.34,66.5 61.34,58.57 v61.37,58.55
  Top 0.305: 47.9,59.84 38.48,59.84 v37.19,58.55 | R32.1 25.1,51.41 25.7,50.8 27.51,50.8 v27.53,50.77 | v29.06,58.34 v34.21,58.34
  Bottom 0.254: U$3.GPIO2 40.81,51.62 | v48.23,62.53 53.52,62.53 53.75,62.76 53.75,65.2 55.07,66.52 61.14,66.52 61.19,66.57 61.26,66.57 v61.34,66.5 | R19.1 59.77,56.68 59.77,58.24 60.07,58.55 v61.37,58.55 63.09,58.55
  Bottom 0.305: v37.19,58.55 37.19,55.54 U$3.GPIO2 | v27.53,50.77 27.53,54.1 28.75,55.32 28.75,58.04 v29.06,58.34 | 36.68,59.05 v37.19,58.55 | v34.21,58.34 36.98,58.34 v37.19,58.55
N$51
  Bottom 0.254: R18.2 63.88,53.57 66.09,51.36 66.09,49.94 65.46,49.3 63.55,49.3 OK2.2
N$52
  Top 0.406: R13.1 48.56,38.45 R14.2
N$53
  Bottom 0.254: R19.2 67.51,56.62 69.42,54.71 69.42,51.18 65.07,46.84 63.58,46.84 OK2.4
N$54  (via drill 0.6)
  Top 0.61: J6.2 67.54,24.92 68.81,26.19 68.81,30.91 v67.64,32.08
  Bottom 0.61: v67.64,32.08 69.42,32.08 71.3,33.96
  Bottom 0.813: X15.2 73.46,31.06 71.3,33.22 71.3,33.96 71.3,39.9 72.64,41.25 75.31,41.25 X15.4
N$55
  Top 0.305: X14.3 10.29,65.28 14.17,61.39 15.52,61.39 16.74,62.61 16.74,65.54 J14.5 19.75,65.62 22.78,68.66 26.71,68.66 C10.1 | R2.2 29.84,93.23 33.4,89.66 34.6,89.66 U$4.A2
  Bottom 0.305: U$4.A2 33.67,89.76 32.87,88.95 32.87,86.56 30.43,84.12 30.38,84.12 26.87,80.62 26.87,75.46 25.6,74.19 22.45,74.19 20.55,72.29 20.55,69.52 J14.5
N$57  (via drill 0.6 pad 1.27)  (4 unrouted)
  other vias: 36.76,119.16 38.76,119.16 42.76,119.16 44.76,119.16 46.76,119.16
N$58  (via drill 0.6 pad 1.27)
  other vias: 34.76,106.66
N$61
  Top 0.305: 40.76,104.22 40.76,100.56 R24.1
  Top 0.406: 40.76,104.22 PADSCK7.1 40.74,106.68 40.74,107.9 41.51,108.67 R25.1
N$62
  Top 0.406: R20.1 35.68,109.08 36.83,107.92 36.83,106.73 PADRST5.1
N$63
  Top 0.305: R23.1 37.93,102.25 38.79,103.1 38.79,104.66 38.76,104.68
  Top 0.406: 38.76,104.68 PADNSS6.1 38.76,109.2 R21.1
N$64
  Top 0.406: R22.1 38.39,111.5 R21.2
N$65
  Top 0.406: R26.1 41.53,111.53 R25.2
N$66
  Top 0.305: 42.76,104.07 42.76,100.59 R27.1
  Top 0.406: 42.76,104.07 PADMOS8.1 42.93,106.82 42.93,107.57 44.75,109.39 R28.1
N$67
  Top 0.406: R29.1 44.76,111.5 R28.2
N$68
  Top 0.61: X16.1 23.76,117.03 26.39,119.66 | 26.39,119.66 26.39,120.29 X7.1 | 26.39,119.66 32.27,119.66 PADANT1.1
N$69  (via drill 3.2)  (1 unrouted)
  other vias: 51.61,108.69 29.61,111.69
N$72  (via drill 0.6)
  Top 0.254: 56.77,40.13 56.77,35.59 v56.64,35.46 | v52.32,78.36 48.44,78.36 v40.72,86.08 | v40.82,71.93 40.16,71.93 37.57,74.52 U$4.5V
  Top 0.305: IC2.3 22.16,44.13 v24.03,46 30.96,46 32.44,44.53 32.44,38.48 33.17,37.74 33.94,37.74 R11.1 | C9.1 26.6,62.73 v27.64,61.7 32.23,61.7 34.62,64.08 34.62,66.82 U$4.RAW | R10.2 26.87,72.42 27.71,71.58 30.86,71.58 v31.55,70.89 | C1.+ 28.37,97.01 R3.2 28.02,93.81 R2.1 27.94,90.4 R1.2 v27.87,88.45 v27.86,88.44 | v31.52,86.92 31.52,79.27 v31.65,79.15 | v69.47,57.12 69.47,62.76 v69.22,63.02 | v68.66,66.37 71.86,69.57 71.86,72.03 71.81,72.09 71.81,72.67 69.82,74.65 69.82,75.06 | 69.82,75.06 69.82,82.12 K1.1 65.22,82.72 61.34,82.72 | D4.C 58.17,75.79 59.89,74.07 67.69,74.07 68.33,74.7 69.47,74.7 69.82,75.06 | v59.61,46.91 59.61,44.12 56.77,41.27 56.77,40.13
  Top 0.406: T6.C 60.93,99.77 v67.28,93.42 | 67.28,84.79 K1.1 67.18,84.76 | K1.C 61.34,82.72 | D4.C 56.21,72.24 D3.C | J6.3 68.07,22.38 72.72,27.03 72.72,30.15 67.41,35.46 v65.71,35.46
  Bottom 0.254: OK2.8 59.06,50.6 59.61,50.04 59.61,48.64 | 59.61,48.64 58.98,48.01 57.43,48.01 OK2.6 | 59.61,48.64 v59.61,46.91 | v56.64,35.46 64.72,35.46 | v65.71,35.46 67.34,37.08 67.34,40.88 K2.1 | v40.72,86.08 40.72,72.03 v40.82,71.93
  Bottom 0.305: U$4.RAW 32.41,66.9 31.55,67.77 v31.55,70.89 31.55,73.43 32.66,74.55 | 32.66,74.55 34.66,74.55 U$4.5V | v27.86,88.44 29.79,88.44 31.22,87.02 31.42,87.02 v31.52,86.92 | v31.65,79.15 31.65,75.56 32.66,74.55 | v27.64,61.7 27.64,56.62 23.75,52.73 23.75,46.28 v24.03,46 | v69.22,63.02 69.22,65.81 v68.66,66.37 | D4.C 54.89,75.79 v52.32,78.36 | v67.28,93.42 67.28,84.79 K1.1
  Bottom 0.406: 72.21,49.91 72.21,54.36 70.08,56.49 70.08,56.51 v69.47,57.12 | v65.71,35.46 64.72,35.46
  Bottom 0.61: K2.1 67.22,44.92 72.21,49.91 75.15,49.91 X2.1 | J1.6 62.15,17.75 63.07,18.67
  Bottom 0.813: 63.07,18.67 63.07,21.64 63.8,22.38 J6.3
SUPPLY  (via drill 0.6)
  Top 0.254: R7.2 26.75,84.81 v26.77,84.84
  Top 0.813: Q1.3 3.98,102.32 5.87,100.43 18.57,100.43 v19.63,99.36 | v19.63,85.12 19.63,58.14 16.94,55.45 v16.94,43.94 | v28.98,23.83 28.98,22.83 33.86,17.96 35.51,17.96 J19.1 35.74,17.73 38.68,17.73 38.81,17.86 38.81,19.28 40.31,20.78 45.67,20.78 47.83,22.94 47.83,23.06 49.28,24.51 52.26,24.51 T4.2
  Bottom 0.254: 35.71,17.88 J19.1 | v26.77,84.84 19.91,84.84 v19.63,85.12
  Bottom 0.61: J19.1 35.71,11.94 37.97,9.68 52.43,9.68 54.18,7.92
  Bottom 0.813: U$2.VCC 54.18,5.58 54.18,7.92 58.75,12.5 64.92,12.5 66.04,13.61 J6.5 | v19.63,99.36 v19.63,85.12 | v16.94,43.94 26.44,43.94 27.91,42.47 28.07,42.47 29.06,41.48 29.06,23.9 v28.98,23.83
(copper drawn outside any net)
  shapes: Bottom area x10

### Text on the board
Top: Vin 12 V | gnd | 3.3v | gnd | Ant | gnd | DI1 | gnd | rst | NO | gnd | C47 | RAIN | WIND | R1k | C47 | C47 | C47 | C4 | gnd | R1k | R1k | R1k | A0A1 | GND | Vo | RF rec | A5A6 | C11 | A4A5/I2C | C12 | RFRX | ANT
Bottom: C47 | C47 | C47